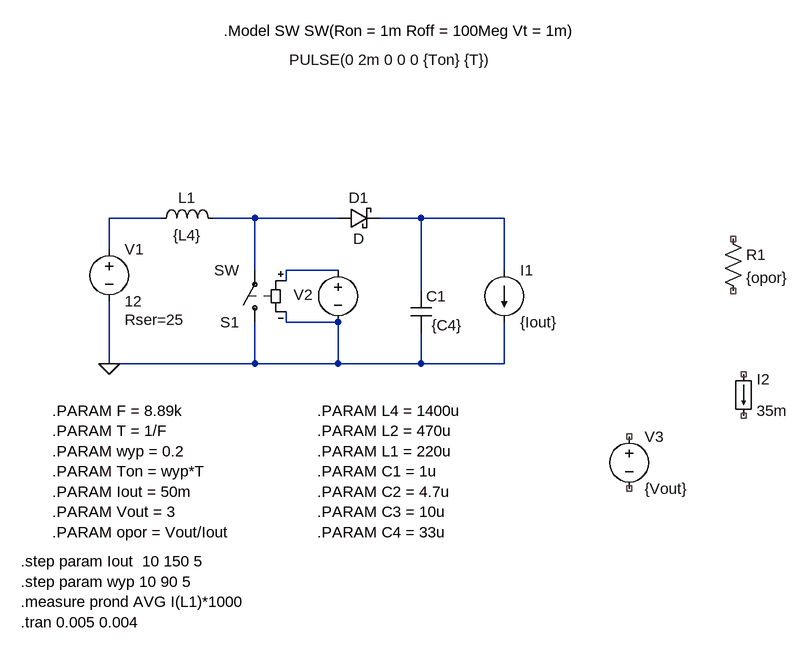
[diagram p0: schematic stepup.asc]
stepup.asc, the LTspice schematic file:
Version 4
SHEET 1 1048 724
WIRE 64 96 -16 96
WIRE 208 96 144 96
WIRE 336 96 208 96
WIRE 464 96 400 96
WIRE 592 96 464 96
WIRE -16 144 -16 96
WIRE 208 176 208 96
WIRE 336 176 256 176
WIRE 592 176 592 96
WIRE 256 192 256 176
WIRE 464 208 464 96
WIRE 256 256 256 240
WIRE 336 256 256 256
WIRE -16 320 -16 224
WIRE 208 320 208 256
WIRE 208 320 -16 320
WIRE 336 320 336 256
WIRE 336 320 208 320
WIRE 464 320 464 272
WIRE 464 320 336 320
WIRE 592 320 592 256
WIRE 592 320 464 320
FLAG -16 320 0
SYMBOL voltage -16 128 R0
WINDOW 123 0 0 Left 0
WINDOW 39 24 124 Left 2
SYMATTR SpiceLine Rser=25
SYMATTR InstName V1
SYMATTR Value 12
SYMBOL cap 448 208 R0
WINDOW 3 32 53 Left 2
SYMATTR Value {C4}
SYMATTR InstName C1
SYMBOL ind 48 112 R270
WINDOW 0 32 56 VTop 2
WINDOW 3 5 56 VBottom 2
SYMATTR InstName L1
SYMATTR Value {L4}
SYMBOL schottky 336 112 R270
WINDOW 0 32 32 VTop 2
WINDOW 3 0 32 VBottom 2
SYMATTR InstName D1
SYMBOL voltage 336 160 R0
WINDOW 123 0 0 Left 0
WINDOW 39 0 0 Left 0
WINDOW 0 -68 54 Left 2
WINDOW 3 -75 -308 Left 2
SYMATTR InstName V2
SYMATTR Value PULSE(0 2m 0 0 0 {Ton} {T})
SYMBOL load 944 336 R0
WINDOW 123 0 0 Left 0
WINDOW 39 0 0 Left 0
SYMATTR InstName I2
SYMATTR Value 35m
SYMBOL sw 208 272 R180
SYMATTR InstName S1
SYMBOL current 592 176 R0
WINDOW 123 0 0 Left 0
WINDOW 39 0 0 Left 0
SYMATTR InstName I1
SYMATTR Value {Iout}
SYMBOL voltage 784 416 R0
WINDOW 123 0 0 Left 0
WINDOW 39 24 124 Left 2
SYMATTR InstName V3
SYMATTR Value {Vout}
SYMBOL res 928 112 R0
SYMATTR InstName R1
SYMATTR Value {opor}
TEXT -104 392 Left 2 !.PARAM F = 8.89k\n.PARAM T = 1/F\n.PARAM wyp = 0.2\n.PARAM Ton = wyp*T\n.PARAM Iout = 50m\n.PARAM Vout = 3\n.PARAM opor = Vout/Iout
TEXT 160 -192 Left 2 !.Model SW SW(Ron = 1m Roff = 100Meg Vt = 1m)
TEXT 304 392 Left 2 !.PARAM L4 = 1400u\n.PARAM L2 = 470u\n.PARAM L1 = 220u\n.PARAM C1 = 1u\n.PARAM C2 = 4.7u\n.PARAM C3 = 10u\n.PARAM C4 = 33u
TEXT -152 624 Left 2 !.step param Iout  10 150 5\n.step param wyp 10 90 5\n.measure prond AVG I(L1)*1000\n.tran 0.005 0.004

The netlist it stands for:
* stepup.asc
V1 N001 0 12 Rser=25
C1 N003 0 {C4}
L1 N001 N002 {L4}
D1 N002 N003 D
V2 N004 0 PULSE(0 2m 0 0 0 {Ton} {T})
I2 NC_01 NC_02 35m
S1 0 N002 N004 0 SW
I1 N003 0 {Iout}
V3 NC_03 NC_04 {Vout}
R1 NC_05 NC_06 {opor}
.model D D
.lib standard.dio
.PARAM F = 8.89k
.PARAM T = 1/F
.PARAM wyp = 0.2
.PARAM Ton = wyp*T
.PARAM Iout = 50m
.PARAM Vout = 3
.PARAM opor = Vout/Iout
.Model SW SW(Ron = 1m Roff = 100Meg Vt = 1m)
.PARAM L4 = 1400u
.PARAM L2 = 470u
.PARAM L1 = 220u
.PARAM C1 = 1u
.PARAM C2 = 4.7u
.PARAM C3 = 10u
.PARAM C4 = 33u
.step param Iout  10 150 5
.step param wyp 10 90 5
.measure prond AVG I(L1)*1000
.tran 0.005 0.004
.backanno
.end